# Altium schematic sheet PowBoardConn.SchDoc: LINPOL12
size A portrait; CheckedBy: Panagiotis Gkountoumis; DocumentNumber: 3; SheetNumber: 3; SheetTotal: 4
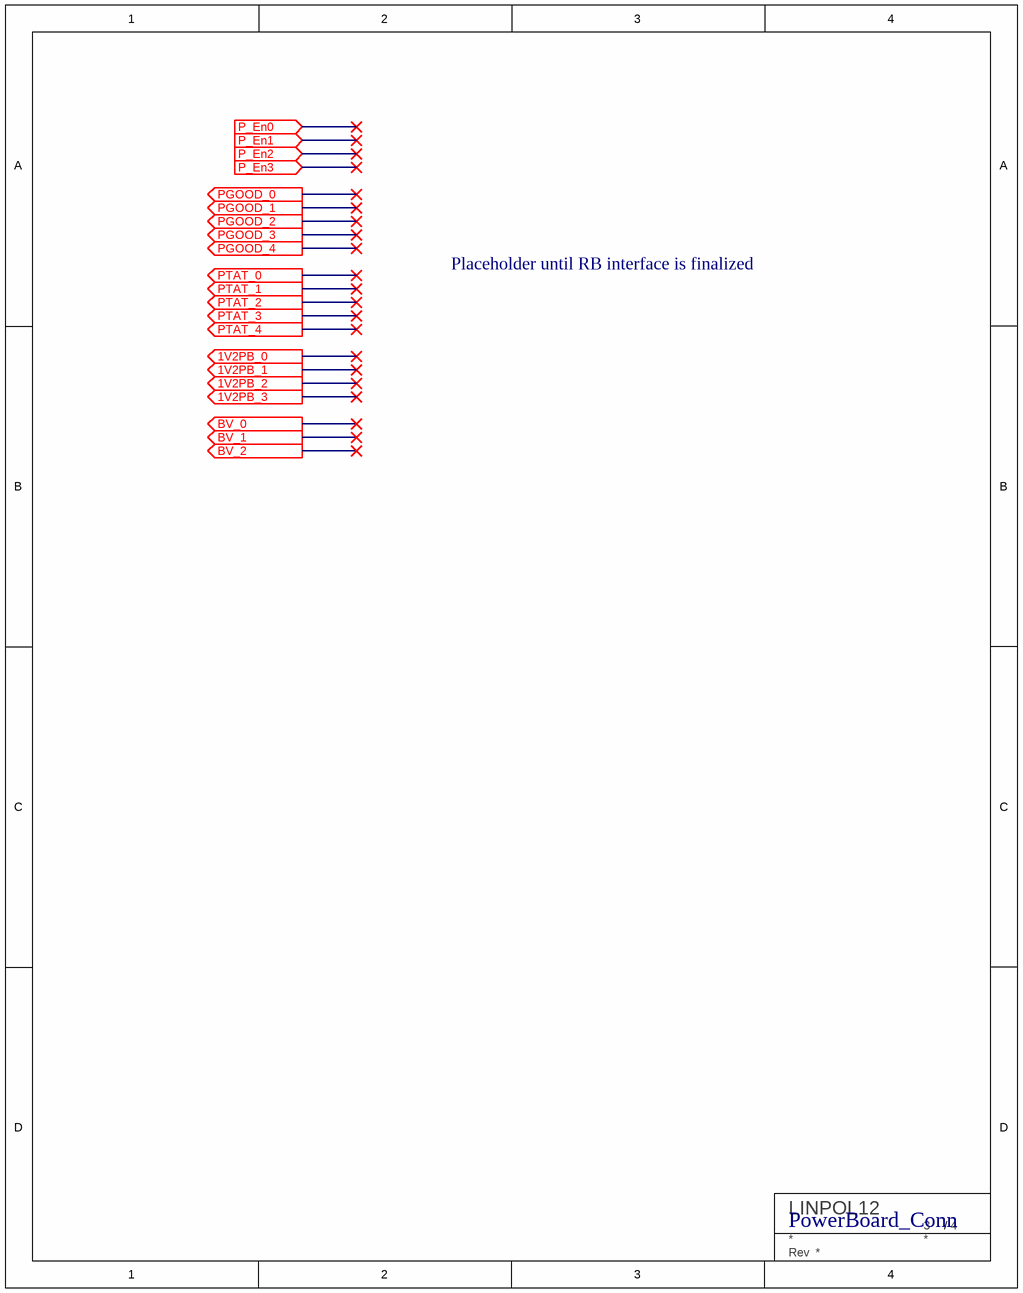
[diagram p0: PowBoardConn.SchDoc]

## Parts
TBLOCK?  BU Title block  (value not drawn)  (graphical)

## Ports
1V2PB_0 (out), 1V2PB_1 (out), 1V2PB_2 (out), 1V2PB_3 (out), BV_0 (out), BV_1 (out), BV_2 (out), P_En0 (in), P_En1 (in), P_En2 (in), P_En3 (in), PGOOD_0 (out), PGOOD_1 (out), PGOOD_2 (out), PGOOD_3 (out), PGOOD_4 (out), PTAT_0 (out), PTAT_1 (out), PTAT_2 (out), PTAT_3 (out), PTAT_4 (out)

## Notes on the sheet
- Placeholder until RB interface is finalized
- (near TBLOCK?) PowerBoard_Conn
- (in symbol TITLE_BLOCK_BU) /; Rev

## Library data of the parts
TBLOCK? = TITLE_BLOCK_BU